# Altium schematic sheet MCU.SchDoc: MCU
size A4; Engineer: Danel Tiitma; DocumentNumber: 3; Revision: 1; SheetNumber: 3; SheetTotal: 15
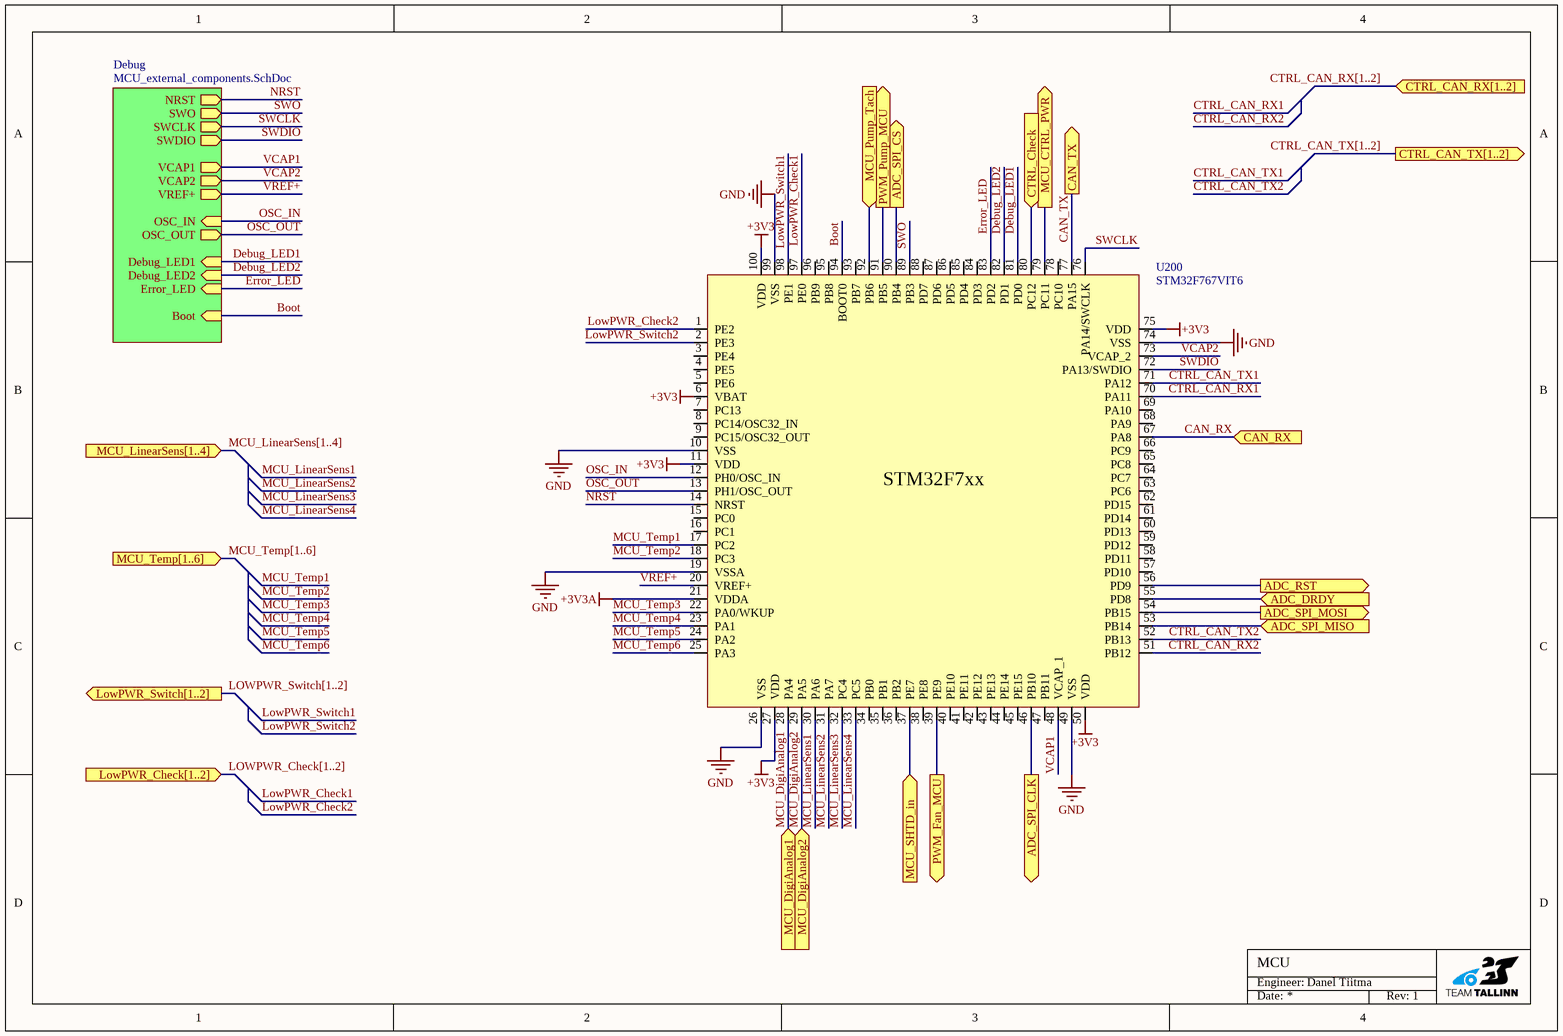
[diagram p0: MCU.SchDoc]

## Parts
U200  STM32F767VIT6  [LQFP-100]

## Sub-sheets
Debug = MCU_external_components.SchDoc: SWO (out), NRST (out), SWDIO (out), SWCLK (out), VCAP2 (out), OSC_IN (in), OSC_OUT (out), VREF+ (out), Debug_LED1 (in), Debug_LED2 (in), Error_LED (in), Boot (in), VCAP1 (out)

## Ports
ADC_DRDY (in), ADC_RST (out), ADC_SPI_CLK (out), ADC_SPI_CS (out), ADC_SPI_MISO (in), ADC_SPI_MOSI (out), CAN_RX (in), CAN_TX (out), CTRL_CAN_RX[1..2] (in), CTRL_CAN_TX[1..2] (out), CTRL_Check (in), LowPWR_Check[1..2] (in), LowPWR_Switch[1..2] (out), MCU_CTRL_PWR (out), MCU_DigiAnalog1 (in), MCU_DigiAnalog2 (in), MCU_LinearSens[1..4] (in), MCU_Pump_Tach (in), MCU_SHTD_in (in), MCU_Temp[1..6] (in), PWM_Fan_MCU (out), PWM_Pump_MCU (out)

## Nets
+3V3: U200.6(VBAT) U200.11(VDD) U200.27(VDD) U200.50(VDD) U200.75(VDD) U200.100(VDD)
+3V3A: U200.21(VDDA)
GND: U200.10(VSS) U200.19(VSSA) U200.26(VSS) U200.49(VSS) U200.74(VSS) U200.99(VSS)
ADC_DRDY: U200.55(PD8) ; port ADC_DRDY
ADC_RST: U200.56(PD9) ; port ADC_RST
ADC_SPI_CLK: U200.46(PB10) ; port ADC_SPI_CLK
ADC_SPI_CS: U200.90(PB4) ; port ADC_SPI_CS
ADC_SPI_MISO: U200.53(PB14) ; port ADC_SPI_MISO
ADC_SPI_MOSI: U200.54(PB15) ; port ADC_SPI_MOSI
Boot: U200.94(BOOT0) ; sheet Debug/Boot
CAN_RX: U200.67(PA8) ; port CAN_RX
CAN_TX: U200.77(PA15) ; port CAN_TX
CTRL_CAN_RX1: U200.70(PA11)
CTRL_CAN_RX2: U200.51(PB12)
CTRL_CAN_TX1: U200.71(PA12)
CTRL_CAN_TX2: U200.52(PB13)
CTRL_Check: U200.80(PC12) ; port CTRL_Check
Debug_LED1: U200.81(PD0) ; sheet Debug/Debug_LED1
Debug_LED2: U200.82(PD1) ; sheet Debug/Debug_LED2
Error_LED: U200.83(PD2) ; sheet Debug/Error_LED
LowPWR_Check1: U200.97(PE0)
LowPWR_Check2: U200.1(PE2)
LowPWR_Switch1: U200.98(PE1)
LowPWR_Switch2: U200.2(PE3)
MCU_CTRL_PWR: U200.79(PC11) ; port MCU_CTRL_PWR
MCU_DigiAnalog1: U200.28(PA4) ; port MCU_DigiAnalog1
MCU_DigiAnalog2: U200.29(PA5) ; port MCU_DigiAnalog2
MCU_LinearSens1: U200.30(PA6)
MCU_LinearSens2: U200.31(PA7)
MCU_LinearSens3: U200.32(PC4)
MCU_LinearSens4: U200.33(PC5)
MCU_Pump_Tach: U200.92(PB6) ; port MCU_Pump_Tach
MCU_SHTD_in: U200.37(PE7) ; port MCU_SHTD_in
MCU_Temp1: U200.17(PC2)
MCU_Temp2: U200.18(PC3)
MCU_Temp3: U200.22(PA0/WKUP)
MCU_Temp4: U200.23(PA1)
MCU_Temp5: U200.24(PA2)
MCU_Temp6: U200.25(PA3)
NRST: U200.14(NRST) ; sheet Debug/NRST
OSC_IN: U200.12(PH0/OSC_IN) ; sheet Debug/OSC_IN
OSC_OUT: U200.13(PH1/OSC_OUT) ; sheet Debug/OSC_OUT
PWM_Fan_MCU: U200.39(PE9) ; port PWM_Fan_MCU
PWM_Pump_MCU: U200.91(PB5) ; port PWM_Pump_MCU
SWCLK: U200.76(PA14/SWCLK) ; sheet Debug/SWCLK
SWDIO: U200.72(PA13/SWDIO) ; sheet Debug/SWDIO
SWO: U200.89(PB3) ; sheet Debug/SWO
VCAP1: U200.48(VCAP_1) ; sheet Debug/VCAP1
VCAP2: U200.73(VCAP_2) ; sheet Debug/VCAP2
VREF+: U200.20(VREF+) ; sheet Debug/VREF+

Not connected (* = marked no-connect by the designer): U200 3(PE4) 4(PE5) 5(PE6) 7(PC13) 8(PC14/OSC32_IN) 9(PC15/OSC32_OUT) 15(PC0) 16(PC1) 34(PB0) 35(PB1) 36(PB2) 38(PE8) 40(PE10) 41(PE11) 42(PE12) 43(PE13) 44(PE14) 45(PE15) 47(PB11) 57(PD10) 58(PD11) 59(PD12) 60(PD13) 61(PD14) 62(PD15) 63(PC6) 64(PC7) 65(PC8) 66(PC9) 68(PA9) 69(PA10) 78(PC10) 84(PD3) 85(PD4) 86(PD5) 87(PD6) 88(PD7) 93(PB7) 95(PB8) 96(PB9)

## Buses and harness runs
bus CTRL_CAN_RX[1..2] = port CTRL_CAN_RX[1..2]
bus CTRL_CAN_TX[1..2] = port CTRL_CAN_TX[1..2]
bus LOWPWR_Check[1..2] = port LowPWR_Check[1..2]
bus LOWPWR_Switch[1..2] = port LowPWR_Switch[1..2]
bus MCU_LinearSens[1..4] = port MCU_LinearSens[1..4]
bus MCU_Temp[1..6] = port MCU_Temp[1..6]

## Notes on the sheet
- Engineer:
- Date:
- Rev:
- (in symbol CMP-020-00001-1) STM32F7xx

## Library data of the parts
U200 = CMP-020-00001-1: RISC Microcontroller, 32-Bit, 216MHz; Manufacturer: STMICROELECTRONICS; Manufacturer Part Number: STM32F767VIT6; Supplier: Mouser; Supplier Part Number: 511-STM32F767VIT6